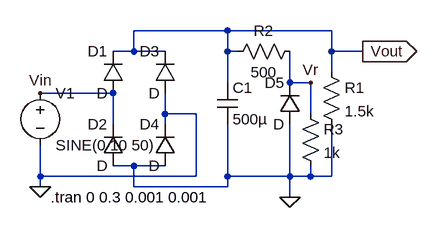
[diagram p0: schematic Draft4.asc]
Draft4.asc, the LTspice schematic file:
Version 4
SHEET 1 880 680
WIRE 352 80 208 80
WIRE 512 80 352 80
WIRE 208 112 208 80
WIRE 208 112 176 112
WIRE 256 112 208 112
WIRE 352 112 352 80
WIRE 368 112 352 112
WIRE 512 112 512 80
WIRE 560 112 512 112
WIRE 512 144 512 112
WIRE 352 160 352 112
WIRE 448 160 448 112
WIRE 480 160 448 160
WIRE 176 176 64 176
WIRE 256 208 256 176
WIRE 304 208 256 208
WIRE 480 208 480 160
WIRE 176 224 176 176
WIRE 256 224 256 208
WIRE 208 288 176 288
WIRE 256 288 208 288
WIRE 64 304 64 256
WIRE 304 304 304 208
WIRE 304 304 64 304
WIRE 352 304 352 224
WIRE 448 304 448 224
WIRE 448 304 352 304
WIRE 480 304 480 288
WIRE 480 304 448 304
WIRE 512 304 512 224
WIRE 512 304 480 304
WIRE 64 320 64 304
WIRE 208 320 208 288
WIRE 352 320 352 304
WIRE 352 320 208 320
WIRE 448 336 448 304
FLAG 64 320 0
FLAG 448 336 0
FLAG 560 112 Vout
IOPIN 560 112 Out
FLAG 480 160 Vr
FLAG 64 176 Vin
SYMBOL diode 192 176 R180
WINDOW 0 24 64 Left 2
WINDOW 3 24 0 Left 2
SYMATTR InstName D1
SYMBOL diode 192 288 R180
WINDOW 0 24 64 Left 2
WINDOW 3 24 0 Left 2
SYMATTR InstName D2
SYMBOL diode 272 176 R180
WINDOW 0 24 64 Left 2
WINDOW 3 24 0 Left 2
SYMATTR InstName D3
SYMBOL diode 272 288 R180
WINDOW 0 24 64 Left 2
WINDOW 3 24 0 Left 2
SYMATTR InstName D4
SYMBOL cap 336 160 R0
SYMATTR InstName C1
SYMATTR Value 500µ
SYMBOL diode 464 224 R180
WINDOW 0 24 64 Left 2
WINDOW 3 24 0 Left 2
SYMATTR InstName D5
SYMBOL res 496 128 R0
SYMATTR InstName R1
SYMATTR Value 1.5k
SYMBOL res 464 96 R90
WINDOW 0 0 56 VBottom 2
WINDOW 3 32 56 VTop 2
SYMATTR InstName R2
SYMATTR Value 500
SYMBOL voltage 64 160 R0
WINDOW 123 24 111 Left 2
WINDOW 39 0 0 Left 0
SYMATTR InstName V1
SYMATTR Value SINE(0 10 50)
SYMBOL res 464 192 R0
SYMATTR InstName R3
SYMATTR Value 1k
TEXT 80 336 Left 2 !.tran 0 0.3 0.001 0.001

The netlist it stands for:
* Draft4.asc
D1 Vin Vout D
D2 0 Vin D
D3 0 Vout D
D4 0 0 D
C1 Vout 0 500µ
D5 0 Vr D
R1 Vout 0 1.5k
R2 Vr Vout 500
V1 Vin 0 SINE(0 10 50)
R3 Vr 0 1k
.model D D
.lib standard.dio
.tran 0 0.3 0.001 0.001
.backanno
.end